# EAGLE schematic SensorPCB (EAGLE 9.5.1)
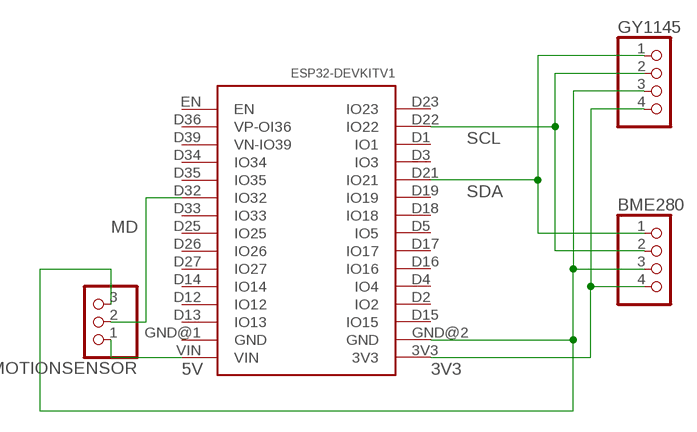
[diagram p0: schematic, sheet 1]

## Parts
BME280  PINHD-1X4  [1X04]
GY1145  PINHD-1X4  [1X04]
MOTIONSENSOR  PINHD-1X3  [1X03]
U$1  ESP32DEVKITV1  [ESP32-DEVKITV1]

## Nets
3V3: BME280.4 GY1145.4 U$1.3V3
5V: MOTIONSENSOR.1 U$1.VIN
GND: BME280.3 GY1145.3 MOTIONSENSOR.3 U$1.GND@2(GND)
MD: MOTIONSENSOR.2 U$1.D32(IO32)
SCL: BME280.2 GY1145.2 U$1.D22(IO22)
SDA: BME280.1 GY1145.1 U$1.D21(IO21)
Unconnected: U$1.D1(IO1) U$1.D2(IO2) U$1.D3(IO3) U$1.D4(IO4) U$1.D5(IO5) U$1.D12(IO12) U$1.D13(IO13) U$1.D14(IO14) U$1.D15(IO15) U$1.D16(IO16) U$1.D17(IO17) U$1.D18(IO18) U$1.D19(IO19) U$1.D23(IO23) U$1.D25(IO25) U$1.D26(IO26) U$1.D27(IO27) U$1.D33(IO33) U$1.D34(IO34) U$1.D35(IO35) U$1.D36(VP-OI36) U$1.D39(VN-IO39) U$1.EN U$1.GND@1(GND)

## Library data of the parts
BME280 GY1145 = pinhead:PINHD-1X4: PIN HEADER
MOTIONSENSOR = pinhead:PINHD-1X3: PIN HEADER
U$1 = ESP32-DEVKITV1:ESP32DEVKITV1